# Altium schematic sheet TLD.SchDoc
size 302 x 195 mm; SheetNumber: 1; SheetTotal: 7
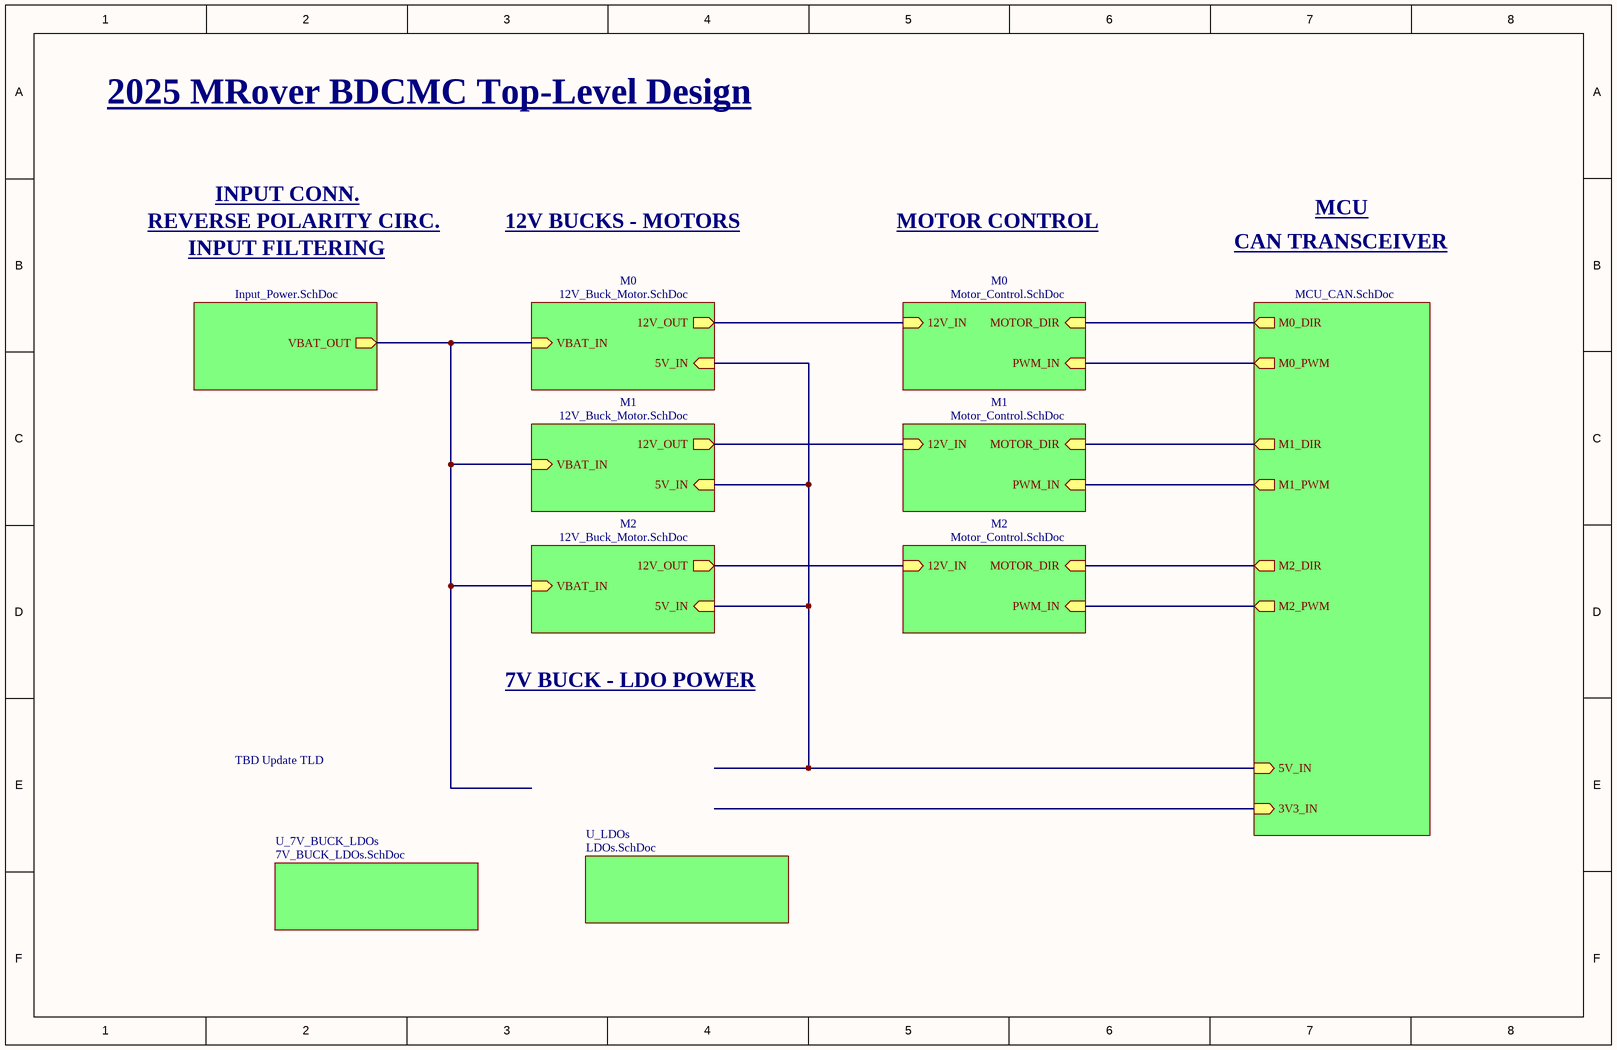
[diagram p0: TLD.SchDoc]

## Sub-sheets
Designator = MCU_CAN.SchDoc: M0_DIR (out), M0_PWM (out), M1_DIR (out), M1_PWM (out), M2_DIR (out), M2_PWM (out), 5V_IN (in), 3V3_IN (in)
Input Power = Input_Power.SchDoc: VBAT_OUT (out)
M0 = 12V_Buck_Motor.SchDoc: VBAT_IN (in), 12V_OUT (out), 5V_IN (in)
M0 = Motor_Control.SchDoc: 12V_IN (in), MOTOR_DIR (in), PWM_IN (in)
M1 = 12V_Buck_Motor.SchDoc: VBAT_IN (in), 12V_OUT (out), 5V_IN (in)
M1 = Motor_Control.SchDoc: 12V_IN (in), MOTOR_DIR (in), PWM_IN (in)
M2 = 12V_Buck_Motor.SchDoc: VBAT_IN (in), 12V_OUT (out), 5V_IN (in)
M2 = Motor_Control.SchDoc: 12V_IN (in), MOTOR_DIR (in), PWM_IN (in)
U_7V_BUCK_LDOs = 7V_BUCK_LDOs.SchDoc: no entries
U_LDOs = LDOs.SchDoc: no entries

## Nets
(unnamed): sheet Input Power/VBAT_OUT, sheet M0/VBAT_IN, sheet M1/VBAT_IN, sheet M2/VBAT_IN
(unnamed): sheet M0/12V_OUT, sheet M0/12V_IN
(unnamed): sheet M0/5V_IN, sheet M1/5V_IN, sheet M2/5V_IN, sheet Designator/5V_IN
(unnamed): sheet M1/12V_OUT, sheet M1/12V_IN
(unnamed): sheet M2/12V_OUT, sheet M2/12V_IN
(unnamed): sheet M0/MOTOR_DIR, sheet Designator/M0_DIR
(unnamed): sheet M0/PWM_IN, sheet Designator/M0_PWM
(unnamed): sheet M1/MOTOR_DIR, sheet Designator/M1_DIR
(unnamed): sheet M1/PWM_IN, sheet Designator/M1_PWM
(unnamed): sheet M2/MOTOR_DIR, sheet Designator/M2_DIR
(unnamed): sheet M2/PWM_IN, sheet Designator/M2_PWM

## Notes on the sheet
- 2025 MRover BDCMC Top-Level Design
- REVERSE POLARITY CIRC.
- INPUT FILTERING
- INPUT CONN.
- 12V BUCKS - MOTORS
- MOTOR CONTROL
- CAN TRANSCEIVER
- MCU
- 7V BUCK - LDO POWER
- TBD Update TLD
- DWG. NO.
- REV.
- SHT.
- REVISION
- DESCRIPTION
- DATE
- APPROVED
- THIS DOCUMENT AND THE DATA DISCLOSED HEREIN OR HEREWITH IS THE PROPERTY OF ALTIUM LIMITED AND MAY BE FREELY DISTRIBUTED IN WHOLE. NO RIGHTS ARE RESERVED OR EXPRESS OR IMPLIED WARANTEE GIVEN.
- ENG:
- DSN:
- APPROVALS
- PROJECT
- DOCUMENT REVISION:
- DESIGN ITEM:
- CHK:
- BOM:
- REFERENCE DOCUMENTS
- PROJECT REVISION:
- TITLE
- FAB DWG:
- PCB DWG:
- ASSY DWG:
- SCALE:
- SIZE
- C
- CAGE CODE
- FILE NAME
- DWG NO.
- SHEET
- OF
- REV